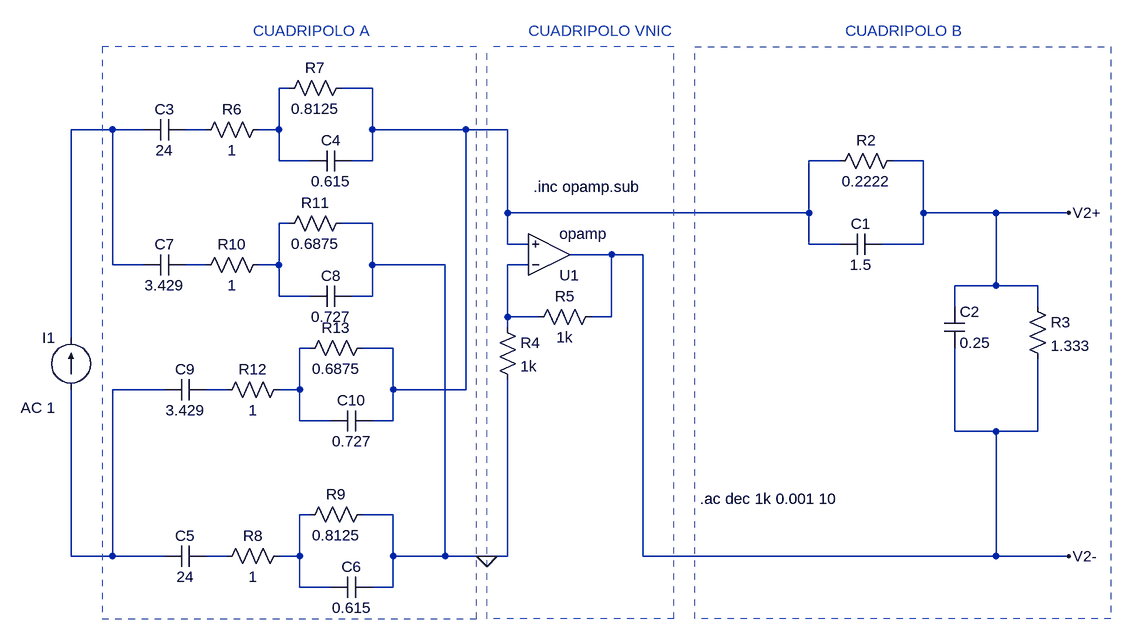
[diagram p0: schematic Z12.asc]
Z12.asc, the LTspice schematic file:
Version 4
SHEET 1 1956 692
WIRE 176 -144 160 -144
WIRE 304 -144 256 -144
WIRE -96 -80 -160 -80
WIRE -48 -80 -96 -80
WIRE 48 -80 16 -80
WIRE 160 -80 160 -144
WIRE 160 -80 128 -80
WIRE 304 -80 304 -144
WIRE 448 -80 304 -80
WIRE 512 -80 448 -80
WIRE 160 -32 160 -80
WIRE 208 -32 160 -32
WIRE 304 -32 304 -80
WIRE 304 -32 272 -32
WIRE 1024 -32 976 -32
WIRE 1152 -32 1104 -32
WIRE 512 48 512 -80
WIRE 976 48 976 -32
WIRE 976 48 512 48
WIRE 1152 48 1152 -32
WIRE 1264 48 1152 48
WIRE 1376 48 1264 48
WIRE 176 64 160 64
WIRE 304 64 256 64
WIRE 512 96 512 48
WIRE 544 96 512 96
WIRE 976 96 976 48
WIRE 1024 96 976 96
WIRE 1152 96 1152 48
WIRE 1152 96 1088 96
WIRE 672 112 608 112
WIRE 720 112 672 112
WIRE -96 128 -96 -80
WIRE -48 128 -96 128
WIRE 48 128 16 128
WIRE 160 128 160 64
WIRE 160 128 128 128
WIRE 304 128 304 64
WIRE 416 128 304 128
WIRE 544 128 512 128
WIRE 1264 160 1264 48
WIRE 1264 160 1200 160
WIRE 1328 160 1264 160
WIRE 160 176 160 128
WIRE 208 176 160 176
WIRE 304 176 304 128
WIRE 304 176 272 176
WIRE 1200 192 1200 160
WIRE 1328 192 1328 160
WIRE 512 208 512 128
WIRE 560 208 512 208
WIRE 672 208 672 112
WIRE 672 208 640 208
WIRE 512 224 512 208
WIRE -160 240 -160 -80
WIRE 208 256 192 256
WIRE 336 256 288 256
WIRE -16 320 -96 320
WIRE 80 320 48 320
WIRE 192 320 192 256
WIRE 192 320 160 320
WIRE 336 320 336 256
WIRE 448 320 448 -80
WIRE 448 320 336 320
WIRE 192 368 192 320
WIRE 240 368 192 368
WIRE 336 368 336 320
WIRE 336 368 304 368
WIRE 1200 384 1200 256
WIRE 1264 384 1200 384
WIRE 1328 384 1328 272
WIRE 1328 384 1264 384
WIRE 208 512 192 512
WIRE 336 512 288 512
WIRE -160 576 -160 320
WIRE -96 576 -96 320
WIRE -96 576 -160 576
WIRE -16 576 -96 576
WIRE 80 576 48 576
WIRE 192 576 192 512
WIRE 192 576 160 576
WIRE 336 576 336 512
WIRE 416 576 416 128
WIRE 416 576 336 576
WIRE 480 576 416 576
WIRE 512 576 512 304
WIRE 512 576 480 576
WIRE 720 576 720 112
WIRE 1264 576 1264 384
WIRE 1264 576 720 576
WIRE 1376 576 1264 576
WIRE 192 624 192 576
WIRE 240 624 192 624
WIRE 336 624 336 576
WIRE 336 624 304 624
FLAG 480 576 0
FLAG 1376 48 V2+
FLAG 1376 576 V2-
SYMBOL res 1120 -48 R90
WINDOW 0 0 56 VBottom 2
WINDOW 3 32 56 VTop 2
SYMATTR InstName R2
SYMATTR Value 0.2222
SYMBOL cap 1088 80 R90
WINDOW 0 0 32 VBottom 2
WINDOW 3 32 32 VTop 2
SYMATTR InstName C1
SYMATTR Value 1.5
SYMBOL cap 1184 192 R0
SYMATTR InstName C2
SYMATTR Value 0.25
SYMBOL res 1312 176 R0
SYMATTR InstName R3
SYMATTR Value 1.333
SYMBOL OpAmps\\opamp 576 176 M180
SYMATTR InstName U1
SYMBOL res 496 208 R0
SYMATTR InstName R4
SYMATTR Value 1k
SYMBOL res 656 192 R90
WINDOW 0 0 56 VBottom 2
WINDOW 3 32 56 VTop 2
SYMATTR InstName R5
SYMATTR Value 1k
SYMBOL current -160 320 R180
WINDOW 0 24 80 Left 2
WINDOW 3 24 0 Left 2
WINDOW 123 24 -28 Left 2
WINDOW 39 0 0 Left 0
SYMATTR InstName I1
SYMATTR Value ""
SYMATTR Value2 AC 1
SYMBOL cap 16 -96 R90
WINDOW 0 0 32 VBottom 2
WINDOW 3 32 32 VTop 2
SYMATTR InstName C3
SYMATTR Value 24
SYMBOL res 144 -96 R90
WINDOW 0 0 56 VBottom 2
WINDOW 3 32 56 VTop 2
SYMATTR InstName R6
SYMATTR Value 1
SYMBOL res 272 -160 R90
WINDOW 0 0 56 VBottom 2
WINDOW 3 32 56 VTop 2
SYMATTR InstName R7
SYMATTR Value 0.8125
SYMBOL cap 272 -48 R90
WINDOW 0 0 32 VBottom 2
WINDOW 3 32 32 VTop 2
SYMATTR InstName C4
SYMATTR Value 0.615
SYMBOL cap 48 560 R90
WINDOW 0 0 32 VBottom 2
WINDOW 3 32 32 VTop 2
SYMATTR InstName C5
SYMATTR Value 24
SYMBOL res 176 560 R90
WINDOW 0 0 56 VBottom 2
WINDOW 3 32 56 VTop 2
SYMATTR InstName R8
SYMATTR Value 1
SYMBOL res 304 496 R90
WINDOW 0 0 56 VBottom 2
WINDOW 3 32 56 VTop 2
SYMATTR InstName R9
SYMATTR Value 0.8125
SYMBOL cap 304 608 R90
WINDOW 0 0 32 VBottom 2
WINDOW 3 32 32 VTop 2
SYMATTR InstName C6
SYMATTR Value 0.615
SYMBOL cap 16 112 R90
WINDOW 0 0 32 VBottom 2
WINDOW 3 32 32 VTop 2
SYMATTR InstName C7
SYMATTR Value 3.429
SYMBOL res 144 112 R90
WINDOW 0 0 56 VBottom 2
WINDOW 3 32 56 VTop 2
SYMATTR InstName R10
SYMATTR Value 1
SYMBOL res 272 48 R90
WINDOW 0 0 56 VBottom 2
WINDOW 3 32 56 VTop 2
SYMATTR InstName R11
SYMATTR Value 0.6875
SYMBOL cap 272 160 R90
WINDOW 0 0 32 VBottom 2
WINDOW 3 32 32 VTop 2
SYMATTR InstName C8
SYMATTR Value 0.727
SYMBOL cap 48 304 R90
WINDOW 0 0 32 VBottom 2
WINDOW 3 32 32 VTop 2
SYMATTR InstName C9
SYMATTR Value 3.429
SYMBOL res 176 304 R90
WINDOW 0 0 56 VBottom 2
WINDOW 3 32 56 VTop 2
SYMATTR InstName R12
SYMATTR Value 1
SYMBOL res 304 240 R90
WINDOW 0 0 56 VBottom 2
WINDOW 3 32 56 VTop 2
SYMATTR InstName R13
SYMATTR Value 0.6875
SYMBOL cap 304 352 R90
WINDOW 0 0 32 VBottom 2
WINDOW 3 32 32 VTop 2
SYMATTR InstName C10
SYMATTR Value 0.727
TEXT 552 8 Left 2 !.inc opamp.sub
TEXT 808 488 Left 2 !.ac dec 1k 0.001 10
TEXT 120 -232 Left 2 ;CUADRIPOLO A
TEXT 544 -232 Left 2 ;CUADRIPOLO VNIC
TEXT 1032 -232 Left 2 ;CUADRIPOLO B
LINE Normal 464 -208 -112 -208 2
LINE Normal 464 672 464 -208 2
LINE Normal -112 672 464 672 2
LINE Normal -112 -208 -112 672 2
LINE Normal 768 -208 480 -208 2
LINE Normal 768 672 768 -208 2
LINE Normal 480 672 480 -208 2
LINE Normal 768 672 480 672 2
RECTANGLE Normal 1440 672 800 -208 2

The netlist it stands for:
* Z12.asc
R2 V2+ N002 0.2222
C1 V2+ N002 1.5
C2 V2+ V2- 0.25
R3 V2+ V2- 1.333
XU1 N007 N002 V2- opamp Aol=100K GBW=10Meg  ; pins invin noninvin out
R4 N007 0 1k
R5 V2- N007 1k
I1 N009 N003 AC 1
C3 N004 N003 24
R6 N001 N004 1
R7 N002 N001 0.8125
C4 N002 N001 0.615
C5 N012 N009 24
R8 N011 N012 1
R9 0 N011 0.8125
C6 0 N011 0.615
C7 N006 N003 3.429
R10 N005 N006 1
R11 0 N005 0.6875
C8 0 N005 0.727
C9 N010 N009 3.429
R12 N008 N010 1
R13 N002 N008 0.6875
C10 N002 N008 0.727
.inc opamp.sub
.ac dec 1k 0.001 10
* CUADRIPOLO A
* CUADRIPOLO VNIC
* CUADRIPOLO B
.backanno
.end